# Altium project Display.PrjPCB
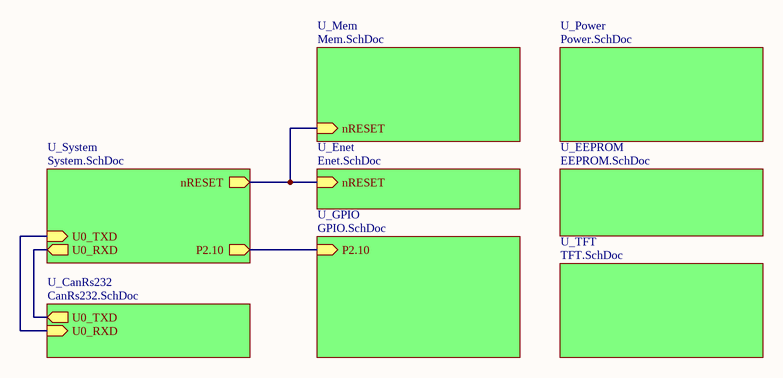
[diagram p0: Top.SchDoc]
9 sheets, 139 parts. Net scope: hierarchical (ports join the sheet entries above them; power ports are global).
Board file: DISPLAY.PcbDoc
Sheets:
  Top.SchDoc
    U_Power = Power.SchDoc
    U_CanRs232 = CanRs232.SchDoc
    U_EEPROM = EEPROM.SchDoc
    U_Enet = Enet.SchDoc
    U_GPIO = GPIO.SchDoc
    U_Mem = Mem.SchDoc
    U_System = System.SchDoc
    U_TFT = TFT.SchDoc

## Sheet Top.SchDoc
size A4

### Sub-sheets
U_CanRs232 = CanRs232.SchDoc: U0_TXD (out), U0_RXD (in)
U_EEPROM = EEPROM.SchDoc: no entries
U_Enet = Enet.SchDoc: nRESET (in)
U_GPIO = GPIO.SchDoc: P2.10 (in)
U_Mem = Mem.SchDoc: nRESET (in)
U_Power = Power.SchDoc: no entries
U_System = System.SchDoc: nRESET (out), P2.10 (out), U0_TXD (in), U0_RXD (out)
U_TFT = TFT.SchDoc: no entries

### Nets
nRESET: sheet U_Enet/nRESET, sheet U_Mem/nRESET, sheet U_System/nRESET
P2.10: sheet U_GPIO/P2.10, sheet U_System/P2.10
U0_RXD: sheet U_CanRs232/U0_TXD, sheet U_System/U0_RXD
U0_TXD: sheet U_CanRs232/U0_RXD, sheet U_System/U0_TXD

## Sheet Power.SchDoc
size 203 x 152 mm; SheetNumber: 0; SheetTotal: 0
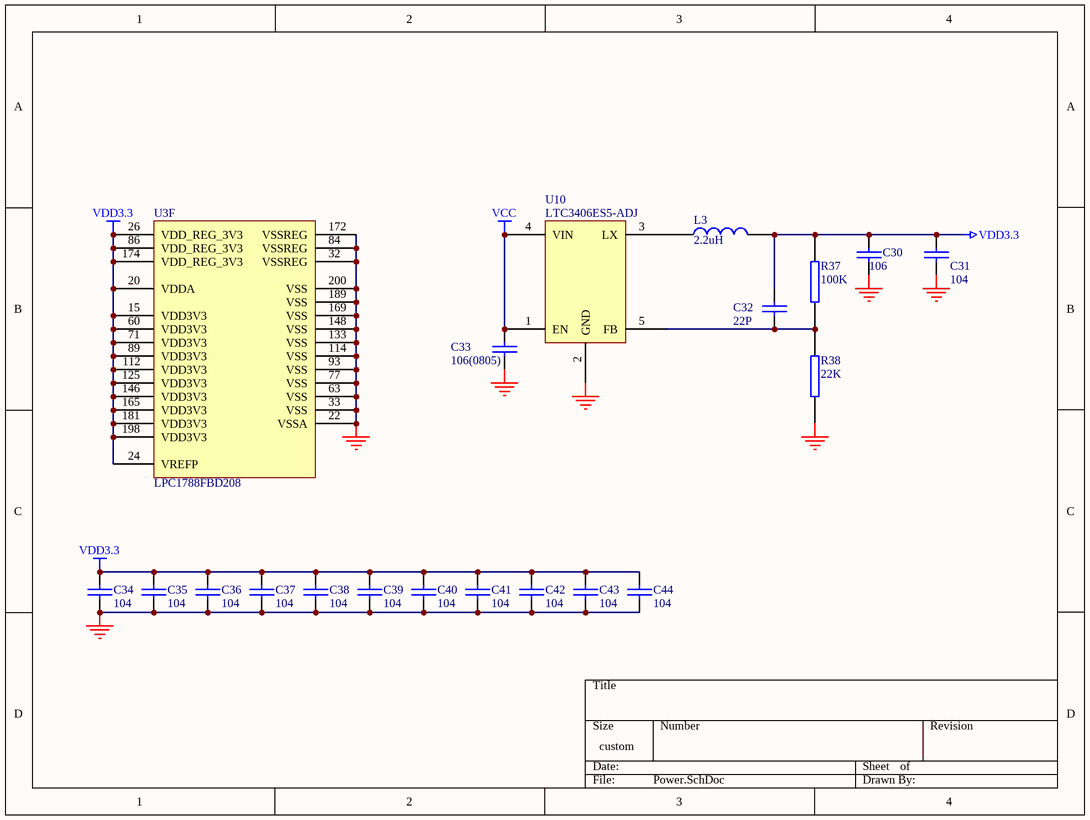
[diagram p1: Power.SchDoc]

### Parts
C30  106  [C0805]
C31  104  [C0603]
C32  22P  [C0603]
C33  106(0805)  [C0805]
C34  104  [C0603]
C35  104  [C0603]
C36  104  [C0603]
C37  104  [C0603]
C38  104  [C0603]
C39  104  [C0603]
C40  104  [C0603]
C41  104  [C0603]
C42  104  [C0603]
C43  104  [C0603]
C44  104  [C0603]
L3  2.2uH  [L4X4]
R37  100K  [R0603]
R38  22K  [R0603]
U3  LPC1788FBD208  [QFP208]  (part F of 8)
U10  LTC3406ES5-ADJ  [SOT23-5]

### Nets
GND: C30.2 C31.2 C33.2 C34.2 C35.2 C36.2 C37.2 C38.2 C39.2 C40.2 C41.2 C42.2 C43.2 C44.2 R38.2 U3.22(VSSA) U3.32(VSSREG) U3.33(VSS) U3.63(VSS) U3.77(VSS) U3.84(VSSREG) U3.93(VSS) U3.114(VSS) U3.133(VSS) U3.148(VSS) U3.169(VSS) U3.172(VSSREG) U3.189(VSS) U3.200(VSS) U10.2(GND)
VCC: C33.1 U10.1(EN) U10.4(VIN)
VDD3.3: C30.1 C31.1 C32.1 C34.1 C35.1 C36.1 C37.1 C38.1 C39.1 C40.1 C41.1 C42.1 C43.1 C44.1 L3.2 R37.2 U3.15(VDD3V3) U3.20(VDDA) U3.24(VREFP) U3.26(VDD_REG_3V3) U3.60(VDD3V3) U3.71(VDD3V3) U3.86(VDD_REG_3V3) U3.89(VDD3V3) U3.112(VDD3V3) U3.125(VDD3V3) U3.146(VDD3V3) U3.165(VDD3V3) U3.174(VDD_REG_3V3) U3.181(VDD3V3) U3.198(VDD3V3)
NetC32_2: C32.2 R37.1 R38.1 U10.5(FB)
NetL3_1: L3.1 U10.3(LX)

### Library data of the parts
C30-C44 = CAP: Capacitor
L3 = INDUCTOR
R37 R38 = RES2
U10 = LTC3406ES5/RT8008

## Sheet CanRs232.SchDoc
size A; SheetNumber: 0; SheetTotal: 0
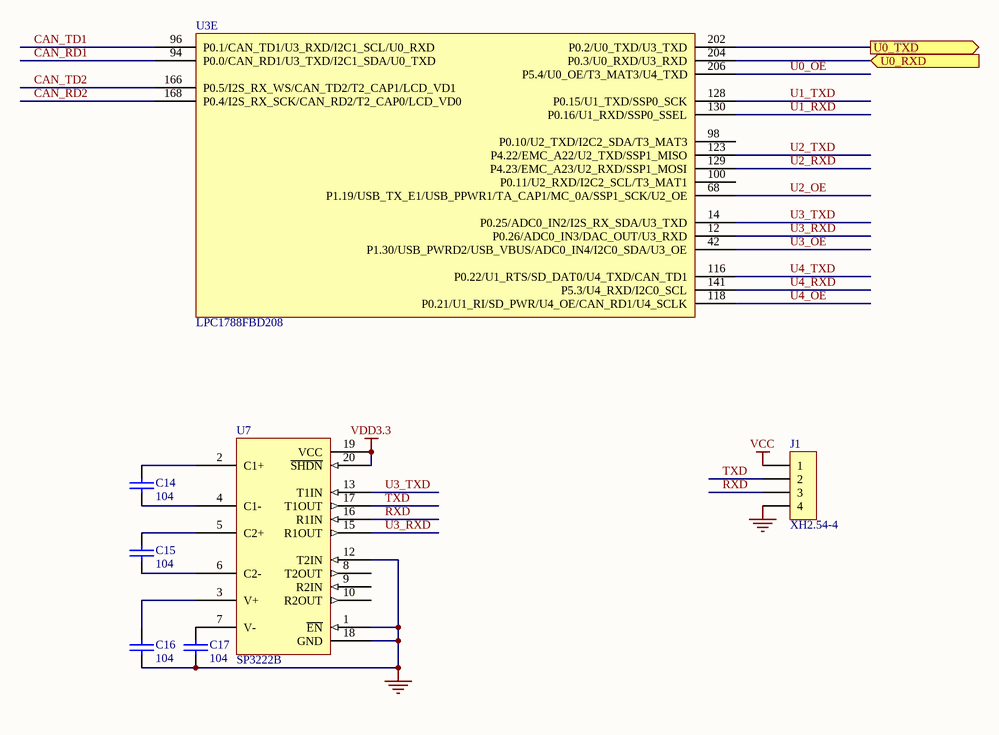
[diagram p2: CanRs232.SchDoc]

### Parts
C14  104  [C1206]
C15  104  [C1206]
C16  104  [C1206]
C17  104  [C1206]
J1  XH2.54-4  [A2501WF-04A]
U3  LPC1788FBD208  [QFP208]  (part E of 8)
U7  SP3222B  [TSSOP20]

### Ports
U0_RXD (in), U0_TXD (out)

### Nets
GND: C16.2 C17.2 J1.4 U7.1(~{EN}) U7.12(T2IN) U7.18(GND)
NC: U7.11(NC) U7.14(NC)
VCC: J1.1
VDD3.3: U7.19(VCC) U7.20(~{SHDN})
CAN_RD1: U3.94(P0.0/CAN_RD1/U3_TXD/I2C1_SDA/U0_TXD)
CAN_RD2: U3.168(P0.4/I2S_RX_SCK/CAN_RD2/T2_CAP0/LCD_VD0)
CAN_TD1: U3.96(P0.1/CAN_TD1/U3_RXD/I2C1_SCL/U0_RXD)
CAN_TD2: U3.166(P0.5/I2S_RX_WS/CAN_TD2/T2_CAP1/LCD_VD1)
RXD: J1.3 U7.16(R1IN)
TXD: J1.2 U7.17(T1OUT)
U0_OE: U3.206(P5.4/U0_OE/T3_MAT3/U4_TXD)
U0_RXD: U3.202(P0.2/U0_TXD/U3_TXD) ; port U0_TXD
U0_TXD: U3.204(P0.3/U0_RXD/U3_RXD) ; port U0_RXD
U1_RXD: U3.130(P0.16/U1_RXD/SSP0_SSEL)
U1_TXD: U3.128(P0.15/U1_TXD/SSP0_SCK)
U2_OE: U3.68(P1.19/USB_TX_E1/USB_PPWR1/TA_CAP1/MC_0A/SSP1_SCK/U2_OE)
U2_RXD: U3.129(P4.23/EMC_A23/U2_RXD/SSP1_MOSI)
U2_TXD: U3.123(P4.22/EMC_A22/U2_TXD/SSP1_MISO)
U3_OE: U3.42(P1.30/USB_PWRD2/USB_VBUS/ADC0_IN4/I2C0_SDA/U3_OE)
U3_RXD: U3.12(P0.26/ADC0_IN3/DAC_OUT/U3_RXD) U7.15(R1OUT)
U3_TXD: U3.14(P0.25/ADC0_IN2/I2S_RX_SDA/U3_TXD) U7.13(T1IN)
U4_OE: U3.118(P0.21/U1_RI/SD_PWR/U4_OE/CAN_RD1/U4_SCLK)
U4_RXD: U3.141(P5.3/U4_RXD/I2C0_SCL)
U4_TXD: U3.116(P0.22/U1_RTS/SD_DAT0/U4_TXD/CAN_TD1)
NetC14_1: C14.1 U7.2(C1+)
NetC14_2: C14.2 U7.4(C1-)
NetC15_1: C15.1 U7.5(C2+)
NetC15_2: C15.2 U7.6(C2-)
NetC16_1: C16.1 U7.3(V+)
NetC17_1: C17.1 U7.7(V-)

Not connected (* = marked no-connect by the designer): U3 98(P0.10/U2_TXD/I2C2_SDA/T3_MAT3) 100(P0.11/U2_RXD/I2C2_SCL/T3_MAT1); U7 8(T2OUT) 9(R2IN) 10(R2OUT)

### Library data of the parts
C14-C17 = CAP
J1 = XH2.54-4-SMD

## Sheet EEPROM.SchDoc
size 241 x 127 mm; SheetNumber: 0; SheetTotal: 0
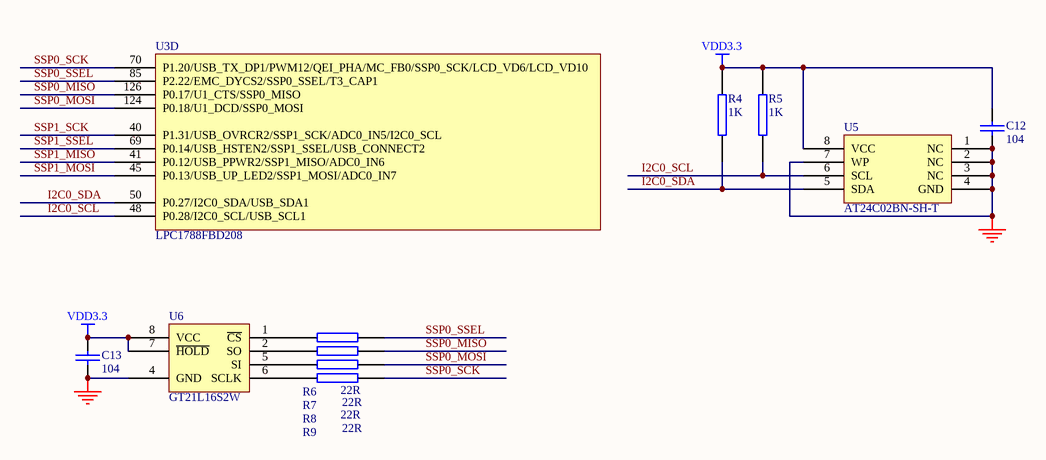
[diagram p3: EEPROM.SchDoc]

### Parts
C12  104  [C0603]
C13  104  [C0603]
R4  1K  [R0603]
R5  1K  [R0603]
R6  22R  [R0603]
R7  22R  [R0603]
R8  22R  [R0603]
R9  22R  [R0603]
U3  LPC1788FBD208  [QFP208]  (part D of 8)
U5  AT24C02BN-SH-T  [SOP8]
U6  GT21L16S2W  [SOP8]

### Nets
GND: C12.2 C13.2 U5.1(NC) U5.2(NC) U5.3(NC) U5.4(GND) U5.7(WP) U6.4(GND)
NC: U6.3(NC)
VDD3.3: C12.1 C13.1 R4.2 R5.2 U5.8(VCC) U6.7(~{HOLD}) U6.8(VCC)
I2C0_SCL: R5.1 U3.48(P0.28/I2C0_SCL/USB_SCL1) U5.6(SCL)
I2C0_SDA: R4.1 U3.50(P0.27/I2C0_SDA/USB_SDA1) U5.5(SDA)
SSP0_MISO: R7.2 U3.126(P0.17/U1_CTS/SSP0_MISO)
SSP0_MOSI: R8.2 U3.124(P0.18/U1_DCD/SSP0_MOSI)
SSP0_SCK: R9.2 U3.70(P1.20/USB_TX_DP1/PWM12/QEI_PHA/MC_FB0/SSP0_SCK/LCD_VD6/LCD_VD10)
SSP0_SSEL: R6.2 U3.85(P2.22/EMC_DYCS2/SSP0_SSEL/T3_CAP1)
SSP1_MISO: U3.41(P0.12/USB_PPWR2/SSP1_MISO/ADC0_IN6)
SSP1_MOSI: U3.45(P0.13/USB_UP_LED2/SSP1_MOSI/ADC0_IN7)
SSP1_SCK: U3.40(P1.31/USB_OVRCR2/SSP1_SCK/ADC0_IN5/I2C0_SCL)
SSP1_SSEL: U3.69(P0.14/USB_HSTEN2/SSP1_SSEL/USB_CONNECT2)
NetR6_1: R6.1 U6.1(~{CS})
NetR7_1: R7.1 U6.2(SO)
NetR8_1: R8.1 U6.5(SI)
NetR9_1: R9.1 U6.6(SCLK)

### Library data of the parts
C12 C13 = CAP: Capacitor
R4-R9 = RES2
U5 = AT24C02
U6 = GT21L16T1W

## Sheet Enet.SchDoc
size B; SheetNumber: 0; SheetTotal: 0
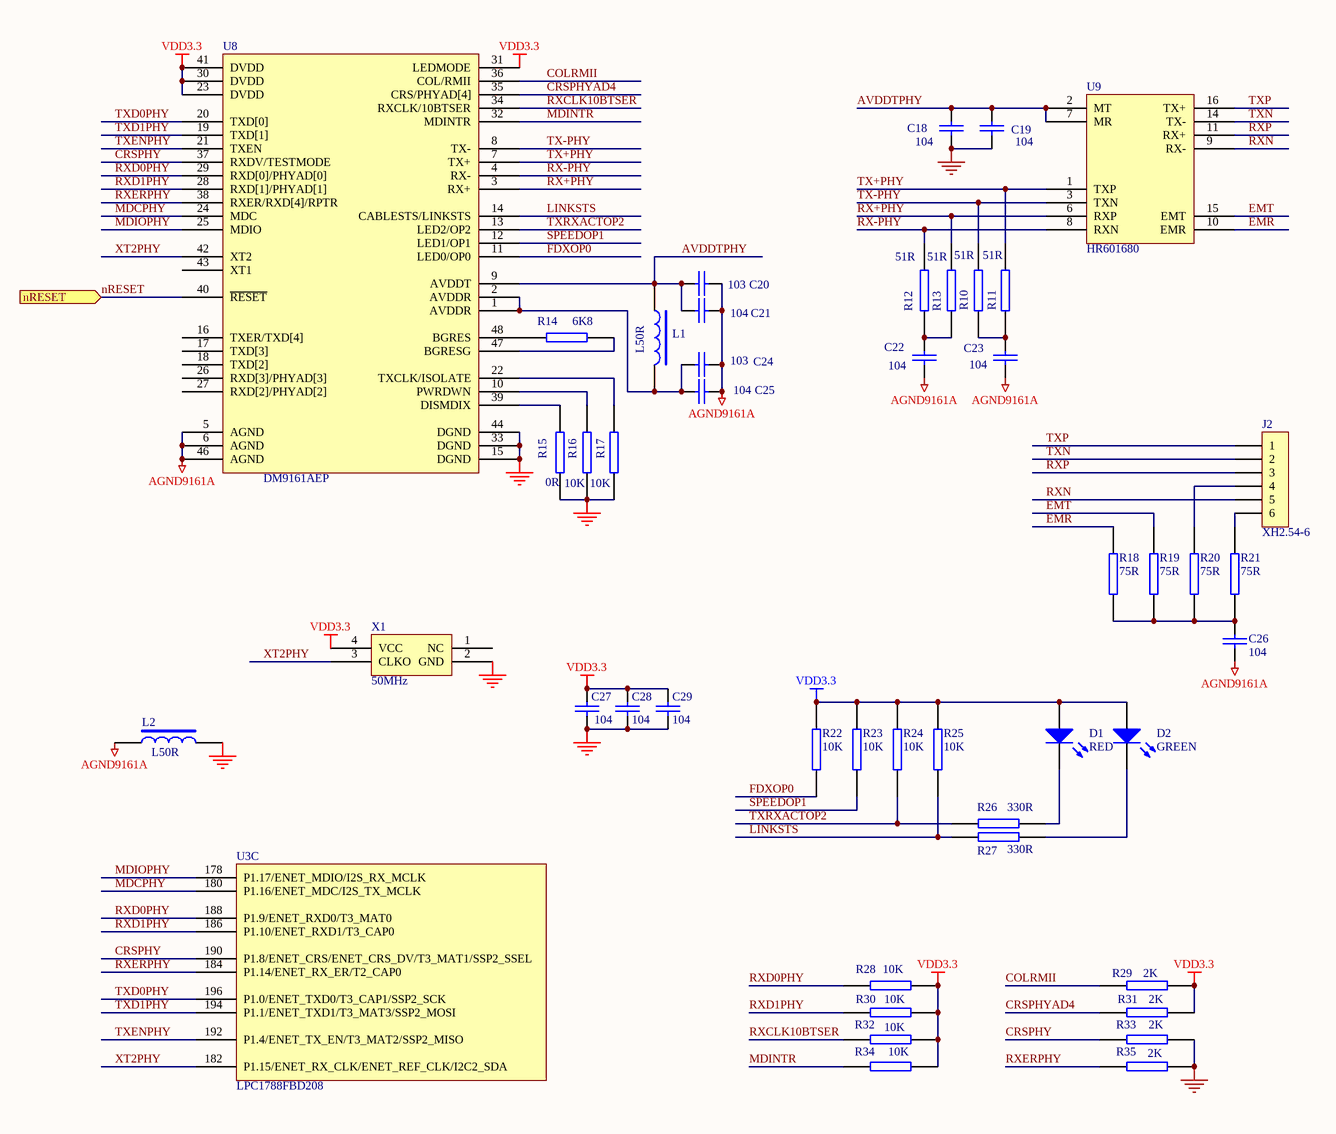
[diagram p4: Enet.SchDoc]

### Parts
C18  104  [C0603]
C19  104  [C0603]
C20  103  [C0603]
C21  104  [C0603]
C22  104  [C0603]
C23  104  [C0603]
C24  103  [C0603]
C25  104  [C0603]
C26  104  [C0603]
C27  104  [C0603]
C28  104  [C0603]
C29  104  [C0603]
D1  RED  [LED0603]
D2  GREEN  [LED0603]
J2  XH2.54-6  [A2501WF-06A]
L1  L50R  [BEADL]
L2  L50R  [BEADL]
R10  51R  [R0603]
R11  51R  [R0603]
R12  51R  [R0603]
R13  51R  [R0603]
R14  6K8  [R0603]
R15  0R  [R0603]
R16  10K  [R0603]
R17  10K  [R0603]
R18  75R  [R0603]
R19  75R  [R0603]
R20  75R  [R0603]
R21  75R  [R0603]
R22  10K  [R0603]
R23  10K  [R0603]
R24  10K  [R0603]
R25  10K  [R0603]
R26  330R  [R0603]
R27  330R  [R0603]
R28  10K  [R0603]
R29  2K  [R0603]
R30  10K  [R0603]
R31  2K  [R0603]
R32  10K  [R0603]
R33  2K  [R0603]
R34  10K  [R0603]
R35  2K  [R0603]
U3  LPC1788FBD208  [QFP208]  (part C of 8)
U8  DM9161AEP  [PQFP48]
U9  HR601680  [HR601680]
X1  50MHz  [CRYSTAL5X8]

### Ports
nRESET (in)

### Nets
AGND9161A: C20.2 C21.2 C22.1 C23.1 C24.2 C25.2 C26.2 L2.1 U8.5(AGND) U8.6(AGND) U8.46(AGND)
GND: C18.1 C19.1 C27.2 C28.2 C29.2 L2.2 R15.1 R16.1 R17.1 R33.2 R35.2 U8.15(DGND) U8.33(DGND) U8.44(DGND) X1.2(GND)
NC: U8.45(NC) U9.4(NC) U9.5(NC) U9.12(NC) U9.13(NC)
VDD3.3: C27.1 C28.1 C29.1 D1.1(A) D2.1(A) R22.2 R23.2 R24.2 R25.2 R28.2 R29.2 R30.2 R31.2 R32.2 R34.2 U8.23(DVDD) U8.30(DVDD) U8.31(LEDMODE) U8.41(DVDD) X1.4(VCC)
AVDDTPHY: C18.2 C19.2 C20.1 C21.1 L1.1 U8.9(AVDDT) U9.2(MT) U9.7(MR)
COLRMII: R29.1 U8.36(COL/RMII)
CRSPHY: R33.1 U3.190(P1.8/ENET_CRS/ENET_CRS_DV/T3_MAT1/SSP2_SSEL) U8.37(RXDV/TESTMODE)
CRSPHYAD4: R31.1 U8.35(CRS/PHYAD[4])
EMR: R18.2 U9.10(EMR)
EMT: R19.2 U9.15(EMT)
FDXOP0: R22.1 U8.11(LED0/OP0)
LINKSTS: R25.1 R27.1 U8.14(CABLESTS/LINKSTS)
MDCPHY: U3.180(P1.16/ENET_MDC/I2S_TX_MCLK) U8.24(MDC)
MDINTR: R34.1 U8.32(MDINTR)
MDIOPHY: U3.178(P1.17/ENET_MDIO/I2S_RX_MCLK) U8.25(MDIO)
nRESET: U8.40(~{RESET}) ; port nRESET
RX+PHY: R13.2 U8.3(RX+) U9.6(RXP)
RX-PHY: R12.2 U8.4(RX-) U9.8(RXN)
RXCLK10BTSER: R32.1 U8.34(RXCLK/10BTSER)
RXD0PHY: R28.1 U3.188(P1.9/ENET_RXD0/T3_MAT0) U8.29(RXD[0]/PHYAD[0])
RXD1PHY: R30.1 U3.186(P1.10/ENET_RXD1/T3_CAP0) U8.28(RXD[1]/PHYAD[1])
RXERPHY: R35.1 U3.184(P1.14/ENET_RX_ER/T2_CAP0) U8.38(RXER/RXD[4]/RPTR)
RXN: J2.5 U9.9(RX-)
RXP: J2.3 U9.11(RX+)
SPEEDOP1: R23.1 U8.12(LED1/OP1)
TX+PHY: R11.2 U8.7(TX+) U9.1(TXP)
TX-PHY: R10.2 U8.8(TX-) U9.3(TXN)
TXD0PHY: U3.196(P1.0/ENET_TXD0/T3_CAP1/SSP2_SCK) U8.20(TXD[0])
TXD1PHY: U3.194(P1.1/ENET_TXD1/T3_MAT3/SSP2_MOSI) U8.19(TXD[1])
TXENPHY: U3.192(P1.4/ENET_TX_EN/T3_MAT2/SSP2_MISO) U8.21(TXEN)
TXN: J2.2 U9.14(TX-)
TXP: J2.1 U9.16(TX+)
TXRXACTOP2: R24.1 R26.1 U8.13(LED2/OP2)
XT2PHY: U3.182(P1.15/ENET_RX_CLK/ENET_REF_CLK/I2C2_SDA) U8.42(XT2) X1.3(CLKO)
NetC22_2: C22.2 R12.1 R13.1
NetC23_2: C23.2 R10.1 R11.1
NetC24_1: C24.1 C25.1 L1.2 U8.1(AVDDR) U8.2(AVDDR)
NetC26_1: C26.1 R18.1 R19.1 R20.1 R21.1
NetD1_2: D1.2(K) R26.2
NetD2_2: D2.2(K) R27.2
NetJ2_4: J2.4 R20.2
NetJ2_6: J2.6 R21.2
NetR14_1: R14.1 U8.47(BGRESG)
NetR14_2: R14.2 U8.48(BGRES)
NetR15_2: R15.2 U8.39(DISMDIX)
NetR16_2: R16.2 U8.10(PWRDWN)
NetR17_2: R17.2 U8.22(TXCLK/ISOLATE)

Not connected (* = marked no-connect by the designer): U8 16(TXER/TXD[4]) 17(TXD[3]) 18(TXD[2]) 26(RXD[3]/PHYAD[3]) 27(RXD[2]/PHYAD[2]) 43(XT1); X1 1(NC)

### Library data of the parts
C18-C29 = CAP: Capacitor
D1 D2 = LED0: Typical INFRARED GaAs LED; Published: 8-Jun-2000; LatestRevisionDate: 08-Jul-2005; LatestRevisionNote: Mech Layer 1 removed.; PackageReference: LED-0; Publisher: Altium Limited
J2 = XH2.54-6-SMD
L1 L2 = INDUCTOR2
R10-R35 = RES2
U8 = DM9161A
X1 = OSCILLATOR

## Sheet GPIO.SchDoc
size A; SheetNumber: 0; SheetTotal: 0
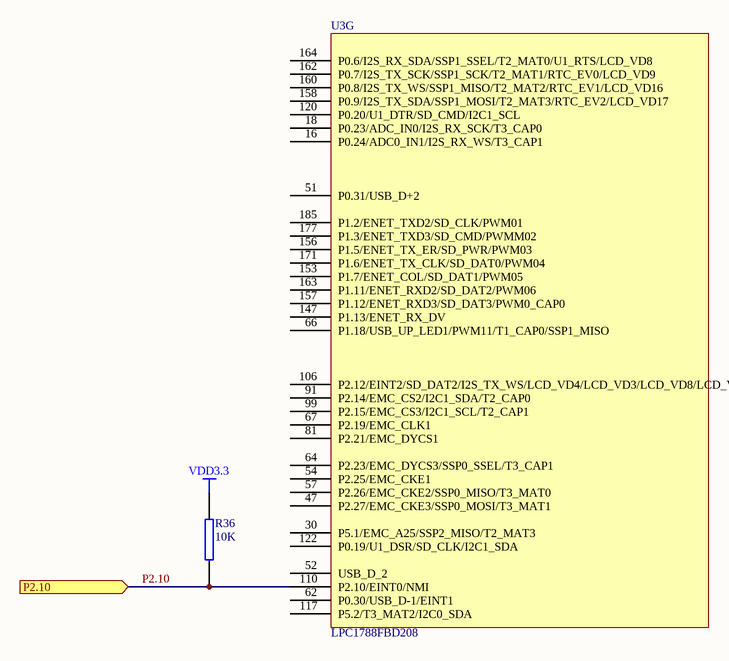
[diagram p5: GPIO.SchDoc]

### Parts
R36  10K  [R0603]
U3  LPC1788FBD208  [QFP208]  (part G of 8)

### Ports
P2.10 (in)

### Nets
VDD3.3: R36.2
P2.10: R36.1 U3.110(P2.10/EINT0/NMI) ; port P2.10

Not connected (* = marked no-connect by the designer): U3 16(P0.24/ADC0_IN1/I2S_RX_WS/T3_CAP1) 18(P0.23/ADC_IN0/I2S_RX_SCK/T3_CAP0) 30(P5.1/EMC_A25/SSP2_MISO/T2_MAT3) 47(P2.27/EMC_CKE3/SSP0_MOSI/T3_MAT1) 51(P0.31/USB_D+2) 52(USB_D_2) 54(P2.25/EMC_CKE1) 57(P2.26/EMC_CKE2/SSP0_MISO/T3_MAT0) 62(P0.30/USB_D-1/EINT1) 64(P2.23/EMC_DYCS3/SSP0_SSEL/T3_CAP1) 66(P1.18/USB_UP_LED1/PWM11/T1_CAP0/SSP1_MISO) 67(P2.19/EMC_CLK1) 81(P2.21/EMC_DYCS1) 91(P2.14/EMC_CS2/I2C1_SDA/T2_CAP0) 99(P2.15/EMC_CS3/I2C1_SCL/T2_CAP1) 106(P2.12/EINT2/SD_DAT2/I2S_TX_WS/LCD_VD4/LCD_VD3/LCD_VD8/LCD_VD18) 117(P5.2/T3_MAT2/I2C0_SDA) 120(P0.20/U1_DTR/SD_CMD/I2C1_SCL) 122(P0.19/U1_DSR/SD_CLK/I2C1_SDA) 147(P1.13/ENET_RX_DV) 153(P1.7/ENET_COL/SD_DAT1/PWM05) 156(P1.5/ENET_TX_ER/SD_PWR/PWM03) 157(P1.12/ENET_RXD3/SD_DAT3/PWM0_CAP0) 158(P0.9/I2S_TX_SDA/SSP1_MOSI/T2_MAT3/RTC_EV2/LCD_VD17) 160(P0.8/I2S_TX_WS/SSP1_MISO/T2_MAT2/RTC_EV1/LCD_VD16) 162(P0.7/I2S_TX_SCK/SSP1_SCK/T2_MAT1/RTC_EV0/LCD_VD9) 163(P1.11/ENET_RXD2/SD_DAT2/PWM06) 164(P0.6/I2S_RX_SDA/SSP1_SSEL/T2_MAT0/U1_RTS/LCD_VD8) 171(P1.6/ENET_TX_CLK/SD_DAT0/PWM04) 177(P1.3/ENET_TXD3/SD_CMD/PWMM02) 185(P1.2/ENET_TXD2/SD_CLK/PWM01)

### Library data of the parts
R36 = RES2

## Sheet Mem.SchDoc
size 355 x 254 mm; SheetNumber: 0; SheetTotal: 0
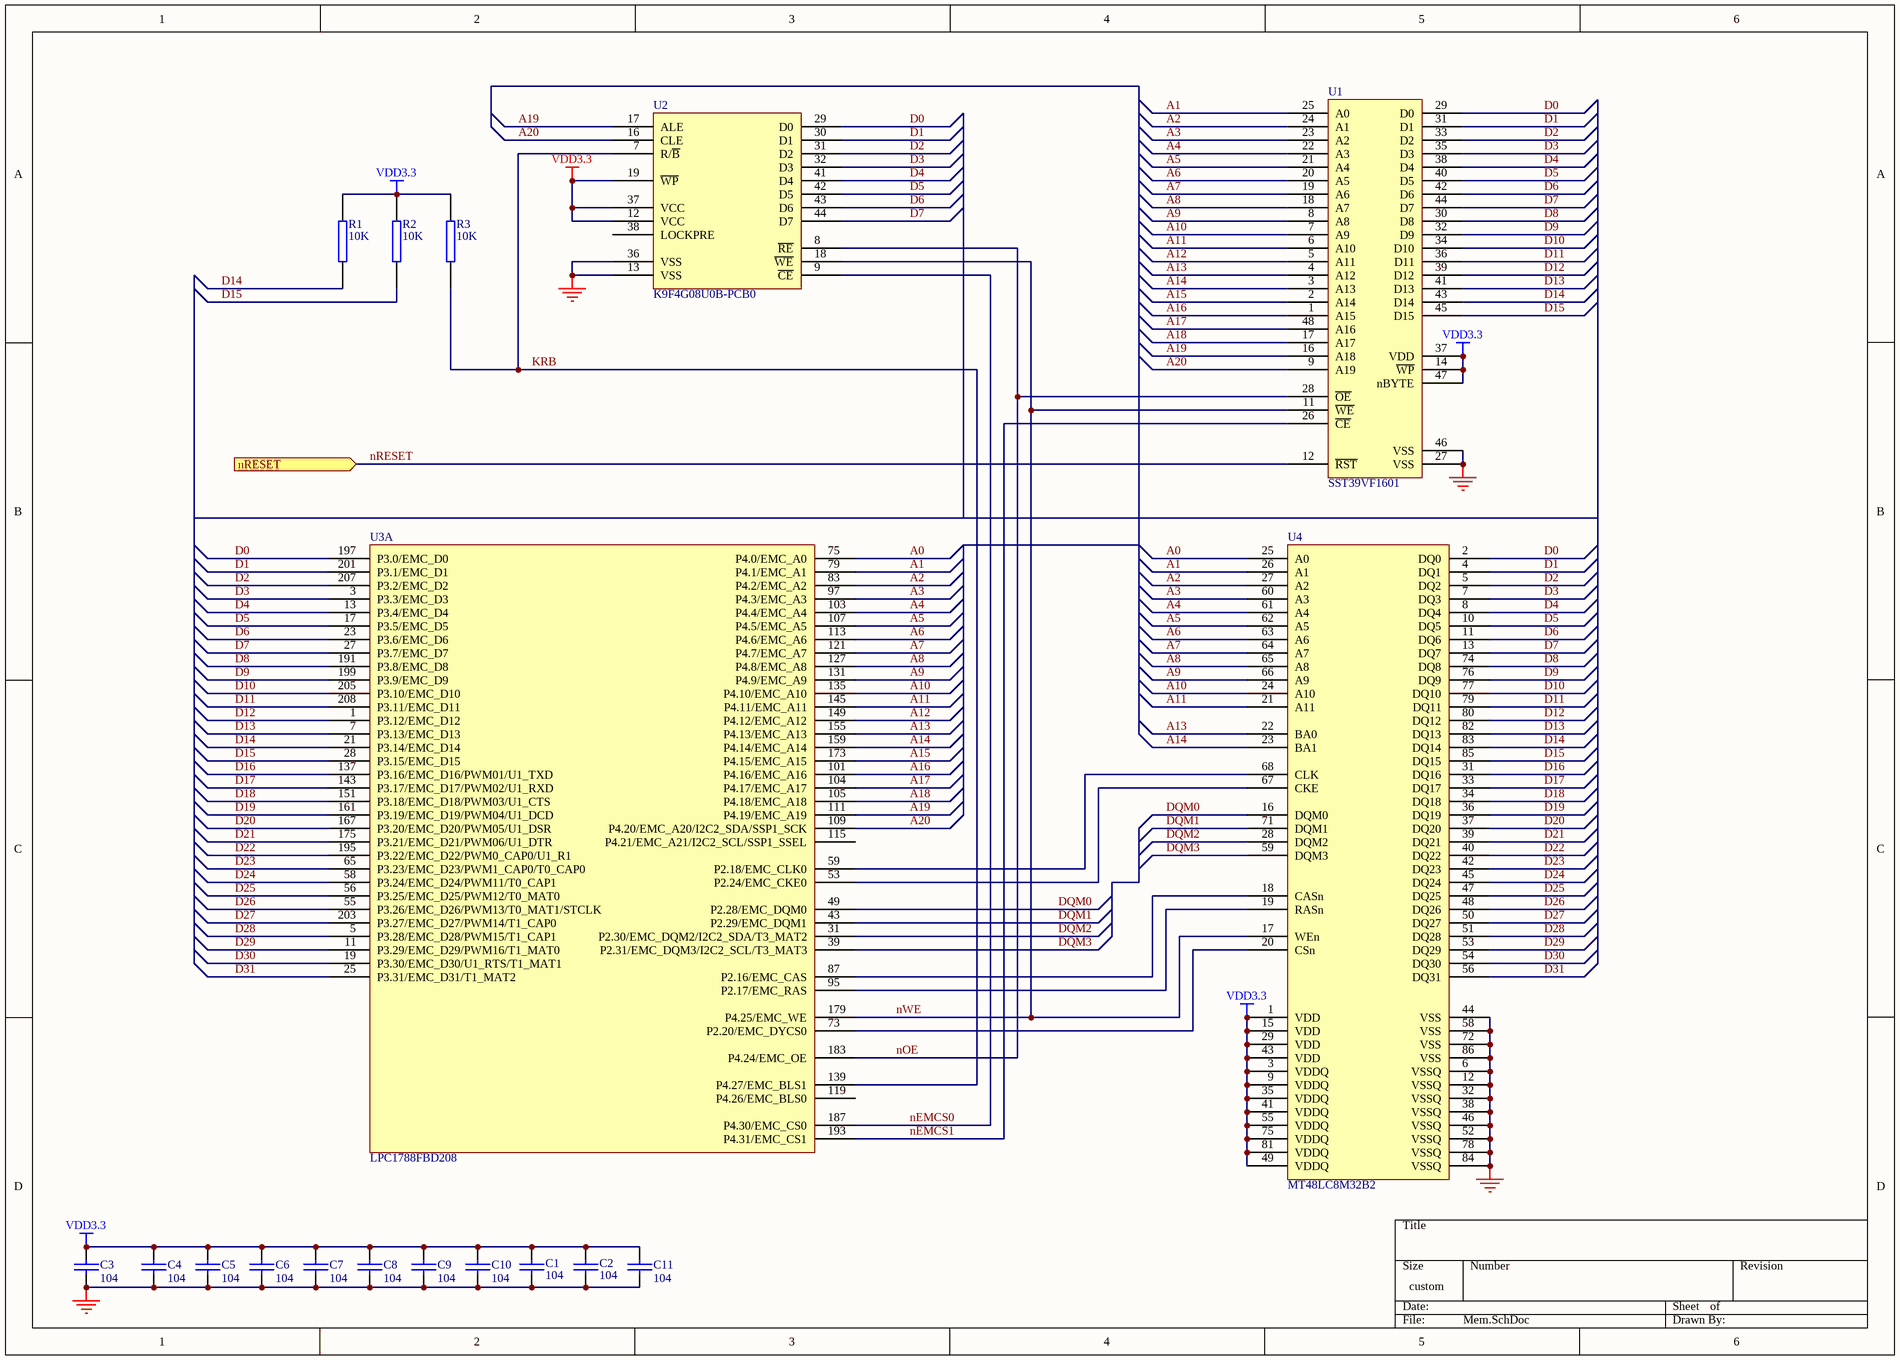
[diagram p6: Mem.SchDoc]

### Parts
C1  104  [C0603]
C2  104  [C0603]
C3  104  [C0603]
C4  104  [C0603]
C5  104  [C0603]
C6  104  [C0603]
C7  104  [C0603]
C8  104  [C0603]
C9  104  [C0603]
C10  104  [C0603]
C11  104  [C0603]
R1  10K  [R0603]
R2  10K  [R0603]
R3  10K  [R0603]
U1  SST39VF1601  [SST39VF1601]
U2  K9F4G08U0B-PCB0  [K9F4G08U0B]
U3  LPC1788FBD208  [QFP208]  (part A of 8)
U4  MT48LC8M32B2  [TSOP86]

### Ports
nRESET (in)

### Nets
GND: C1.2 C2.2 C3.2 C4.2 C5.2 C6.2 C7.2 C8.2 C9.2 C10.2 C11.2 U1.27(VSS) U1.46(VSS) U2.13(VSS) U2.36(VSS) U4.6(VSSQ) U4.12(VSSQ) U4.32(VSSQ) U4.38(VSSQ) U4.44(VSS) U4.46(VSSQ) U4.52(VSSQ) U4.58(VSS) U4.72(VSS) U4.78(VSSQ) U4.84(VSSQ) U4.86(VSS)
NC: U1.10(NC) U1.13(NC) U1.15(NC) U2.1(NC) U2.2(NC) U2.3(NC) U2.4(NC) U2.5(NC) U2.6(NC) U2.10(NC) U2.11(NC) U2.14(NC) U2.15(NC) U2.20(NC) U2.21(NC) U2.22(NC) U2.23(NC) U2.24(NC) U2.25(NC) U2.26(NC) U2.27(NC) U2.28(NC) U2.33(NC) U2.34(NC) U2.35(NC) U2.39(NC) U2.40(NC) U2.45(NC) U2.46(NC) U2.47(NC) U2.48(NC) U4.14(NC) U4.30(NC) U4.57(NC) U4.69(NC) U4.70(NC) U4.73(NC)
VDD3.3: C1.1 C2.1 C3.1 C4.1 C5.1 C6.1 C7.1 C8.1 C9.1 C10.1 C11.1 R1.2 R2.2 R3.2 U1.14(~{WP}) U1.37(VDD) U1.47(nBYTE) U2.12(VCC) U2.19(~{WP}) U2.37(VCC) U4.1(VDD) U4.3(VDDQ) U4.9(VDDQ) U4.15(VDD) U4.29(VDD) U4.35(VDDQ) U4.41(VDDQ) U4.43(VDD) U4.49(VDDQ) U4.55(VDDQ) U4.75(VDDQ) U4.81(VDDQ)
A0: U3.75(P4.0/EMC_A0) U4.25(A0)
A1: U1.25(A0) U3.79(P4.1/EMC_A1) U4.26(A1)
A2: U1.24(A1) U3.83(P4.2/EMC_A2) U4.27(A2)
A3: U1.23(A2) U3.97(P4.3/EMC_A3) U4.60(A3)
A4: U1.22(A3) U3.103(P4.4/EMC_A4) U4.61(A4)
A5: U1.21(A4) U3.107(P4.5/EMC_A5) U4.62(A5)
A6: U1.20(A5) U3.113(P4.6/EMC_A6) U4.63(A6)
A7: U1.19(A6) U3.121(P4.7/EMC_A7) U4.64(A7)
A8: U1.18(A7) U3.127(P4.8/EMC_A8) U4.65(A8)
A9: U1.8(A8) U3.131(P4.9/EMC_A9) U4.66(A9)
A10: U1.7(A9) U3.135(P4.10/EMC_A10) U4.24(A10)
A11: U1.6(A10) U3.145(P4.11/EMC_A11) U4.21(A11)
A12: U1.5(A11) U3.149(P4.12/EMC_A12)
A13: U1.4(A12) U3.155(P4.13/EMC_A13) U4.22(BA0)
A14: U1.3(A13) U3.159(P4.14/EMC_A14) U4.23(BA1)
A15: U1.2(A14) U3.173(P4.15/EMC_A15)
A16: U1.1(A15) U3.101(P4.16/EMC_A16)
A17: U1.48(A16) U3.104(P4.17/EMC_A17)
A18: U1.17(A17) U3.105(P4.18/EMC_A18)
A19: U1.16(A18) U2.17(ALE) U3.111(P4.19/EMC_A19)
A20: U1.9(A19) U2.16(CLE) U3.109(P4.20/EMC_A20/I2C2_SDA/SSP1_SCK)
D0: U1.29(D0) U2.29(D0) U3.197(P3.0/EMC_D0) U4.2(DQ0)
D1: U1.31(D1) U2.30(D1) U3.201(P3.1/EMC_D1) U4.4(DQ1)
D2: U1.33(D2) U2.31(D2) U3.207(P3.2/EMC_D2) U4.5(DQ2)
D3: U1.35(D3) U2.32(D3) U3.3(P3.3/EMC_D3) U4.7(DQ3)
D4: U1.38(D4) U2.41(D4) U3.13(P3.4/EMC_D4) U4.8(DQ4)
D5: U1.40(D5) U2.42(D5) U3.17(P3.5/EMC_D5) U4.10(DQ5)
D6: U1.42(D6) U2.43(D6) U3.23(P3.6/EMC_D6) U4.11(DQ6)
D7: U1.44(D7) U2.44(D7) U3.27(P3.7/EMC_D7) U4.13(DQ7)
D8: U1.30(D8) U3.191(P3.8/EMC_D8) U4.74(DQ8)
D9: U1.32(D9) U3.199(P3.9/EMC_D9) U4.76(DQ9)
D10: U1.34(D10) U3.205(P3.10/EMC_D10) U4.77(DQ10)
D11: U1.36(D11) U3.208(P3.11/EMC_D11) U4.79(DQ11)
D12: U1.39(D12) U3.1(P3.12/EMC_D12) U4.80(DQ12)
D13: U1.41(D13) U3.7(P3.13/EMC_D13) U4.82(DQ13)
D14: R1.1 U1.43(D14) U3.21(P3.14/EMC_D14) U4.83(DQ14)
D15: R2.1 U1.45(D15) U3.28(P3.15/EMC_D15) U4.85(DQ15)
D16: U3.137(P3.16/EMC_D16/PWM01/U1_TXD) U4.31(DQ16)
D17: U3.143(P3.17/EMC_D17/PWM02/U1_RXD) U4.33(DQ17)
D18: U3.151(P3.18/EMC_D18/PWM03/U1_CTS) U4.34(DQ18)
D19: U3.161(P3.19/EMC_D19/PWM04/U1_DCD) U4.36(DQ19)
D20: U3.167(P3.20/EMC_D20/PWM05/U1_DSR) U4.37(DQ20)
D21: U3.175(P3.21/EMC_D21/PWM06/U1_DTR) U4.39(DQ21)
D22: U3.195(P3.22/EMC_D22/PWM0_CAP0/U1_R1) U4.40(DQ22)
D23: U3.65(P3.23/EMC_D23/PWM1_CAP0/T0_CAP0) U4.42(DQ23)
D24: U3.58(P3.24/EMC_D24/PWM11/T0_CAP1) U4.45(DQ24)
D25: U3.56(P3.25/EMC_D25/PWM12/T0_MAT0) U4.47(DQ25)
D26: U3.55(P3.26/EMC_D26/PWM13/T0_MAT1/STCLK) U4.48(DQ26)
D27: U3.203(P3.27/EMC_D27/PWM14/T1_CAP0) U4.50(DQ27)
D28: U3.5(P3.28/EMC_D28/PWM15/T1_CAP1) U4.51(DQ28)
D29: U3.11(P3.29/EMC_D29/PWM16/T1_MAT0) U4.53(DQ29)
D30: U3.19(P3.30/EMC_D30/U1_RTS/T1_MAT1) U4.54(DQ30)
D31: U3.25(P3.31/EMC_D31/T1_MAT2) U4.56(DQ31)
DQM0: U3.49(P2.28/EMC_DQM0) U4.16(DQM0)
DQM1: U3.43(P2.29/EMC_DQM1) U4.71(DQM1)
DQM2: U3.31(P2.30/EMC_DQM2/I2C2_SDA/T3_MAT2) U4.28(DQM2)
DQM3: U3.39(P2.31/EMC_DQM3/I2C2_SCL/T3_MAT3) U4.59(DQM3)
KRB: R3.1 U2.7(R/~{B}) U3.139(P4.27/EMC_BLS1)
nEMCS0: U2.9(~{CE}) U3.187(P4.30/EMC_CS0)
nEMCS1: U1.26(~{CE}) U3.193(P4.31/EMC_CS1)
nOE: U1.28(~{OE}) U2.8(~{RE}) U3.183(P4.24/EMC_OE)
nRESET: U1.12(~{RST}) ; port nRESET
nWE: U1.11(~{WE}) U2.18(~{WE}) U3.179(P4.25/EMC_WE) U4.17(WEn)
NetU3_53: U3.53(P2.24/EMC_CKE0) U4.67(CKE)
NetU3_59: U3.59(P2.18/EMC_CLK0) U4.68(CLK)
NetU3_73: U3.73(P2.20/EMC_DYCS0) U4.20(CSn)
NetU3_87: U3.87(P2.16/EMC_CAS) U4.18(CASn)
NetU3_95: U3.95(P2.17/EMC_RAS) U4.19(RASn)

Not connected (* = marked no-connect by the designer): U2 38(LOCKPRE); U3 115(P4.21/EMC_A21/I2C2_SCL/SSP1_SSEL) 119(P4.26/EMC_BLS0)

### Library data of the parts
C1-C11 = CAP: Capacitor
R1-R3 = RES2
U2 = K9F5608U0D-PCB0

## Sheet System.SchDoc
size 304 x 203 mm; SheetNumber: 0; SheetTotal: 0
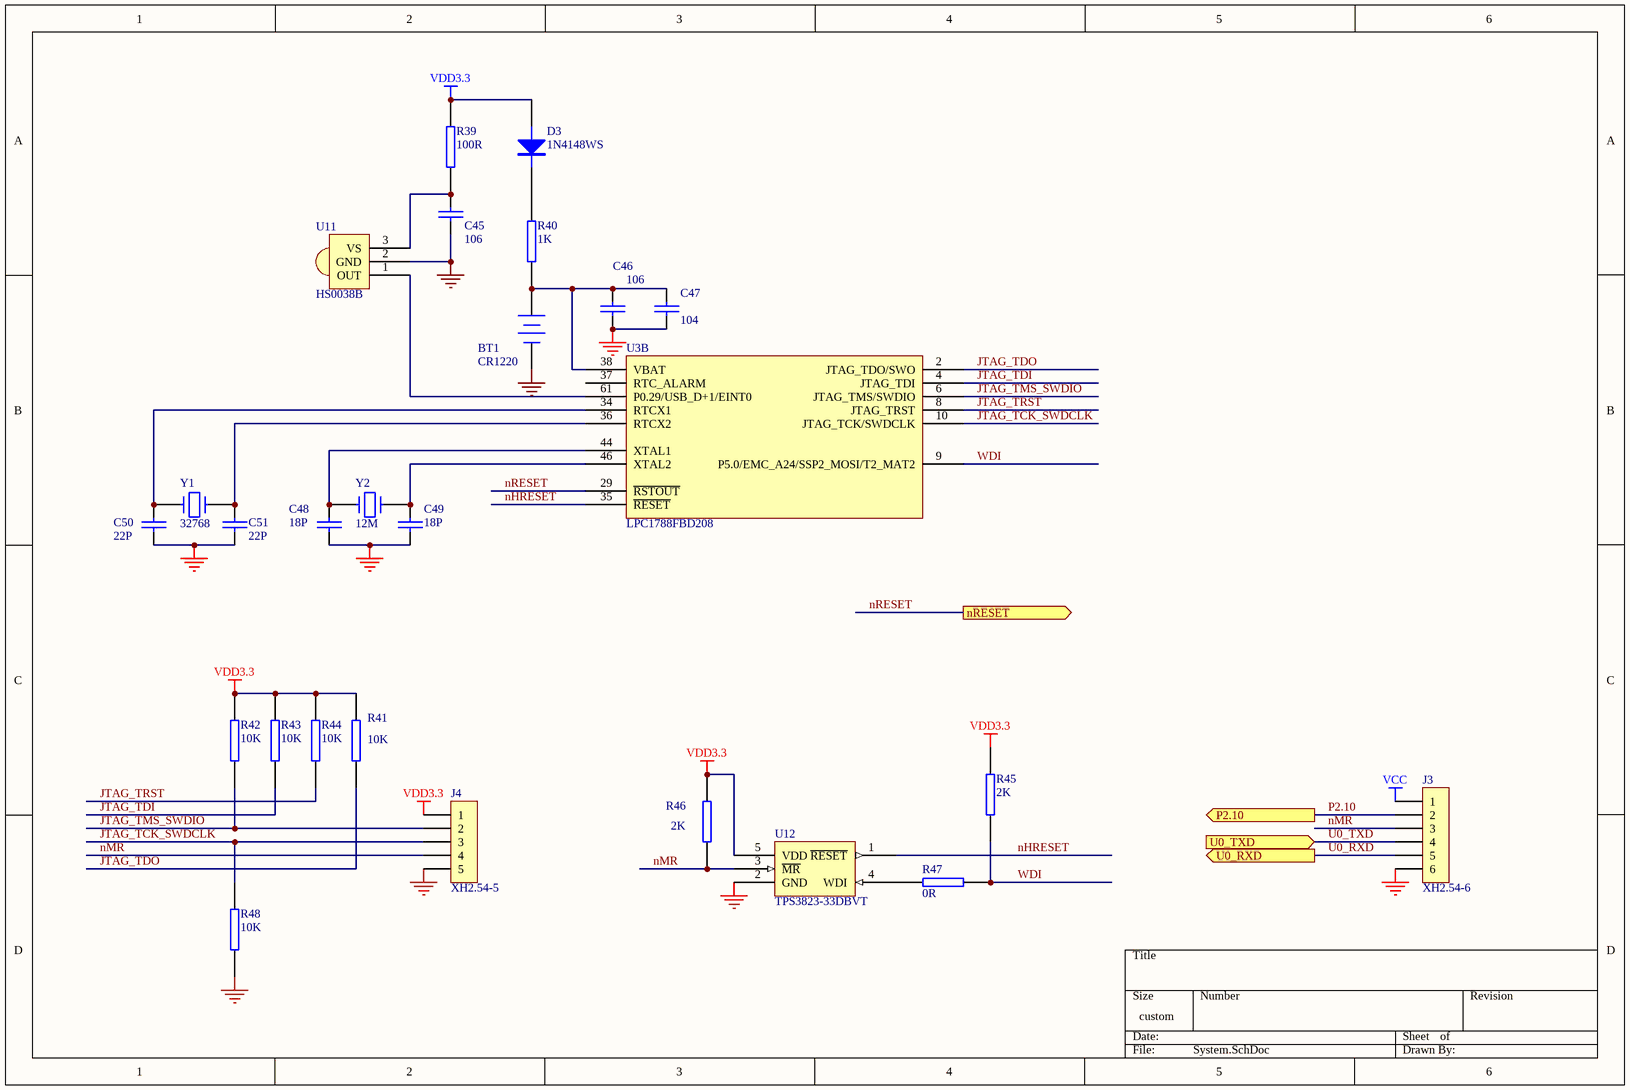
[diagram p7: System.SchDoc]

### Parts
BT1  CR1220  [CR1220]
C45  106  [C0603]
C46  106  [C0603]
C47  104  [C0603]
C48  18P  [C0603]
C49  18P  [C0603]
C50  22P  [C0603]
C51  22P  [C0603]
D3  1N4148WS  [SOD323]
J3  XH2.54-6  [A2501WF-06A]
J4  XH2.54-5  [A2501WF-05A]
R39  100R  [R0603]
R40  1K  [R0603]
R41  10K  [R0603]
R42  10K  [R0603]
R43  10K  [R0603]
R44  10K  [R0603]
R45  2K  [R0603]
R46  2K  [R0603]
R47  0R  [R0603]
R48  10K  [R0603]
U3  LPC1788FBD208  [QFP208]  (part B of 8)
U11  HS0038B  [HS0038B]
U12  TPS3823-33DBVT  [TSOP-5]
Y1  32768  [MC-306]
Y2  12M  [CY5032]

### Ports
nRESET (out), P2.10 (out), U0_RXD (out), U0_TXD (in)

### Nets
GND: BT1.2(-) C45.2 C46.2 C47.2 C48.2 C49.2 C50.2 C51.2 J3.6 J4.5 R48.1 U11.2(GND) U12.2(GND)
VCC: J3.1
VDD3.3: D3.1(A) J4.1 R39.2 R41.2 R42.2 R43.2 R44.2 R45.2 R46.2 U12.5(VDD)
JTAG_TCK_SWDCLK: J4.3 R48.2 U3.10(JTAG_TCK/SWDCLK)
JTAG_TDI: R43.1 U3.4(JTAG_TDI)
JTAG_TDO: R41.1 U3.2(JTAG_TDO/SWO)
JTAG_TMS_SWDIO: J4.2 R42.1 U3.6(JTAG_TMS/SWDIO)
JTAG_TRST: R44.1 U3.8(JTAG_TRST)
nHRESET: U3.35(~{RESET}) U12.1(~{RESET})
nMR: J3.3 J4.4 R46.1 U12.3(~{MR})
nRESET: U3.29(~{RSTOUT}) ; port nRESET
P2.10: J3.2 ; port P2.10
U0_RXD: J3.5 ; port U0_RXD
U0_TXD: J3.4 ; port U0_TXD
WDI: R45.1 R47.2 U3.9(P5.0/EMC_A24/SSP2_MOSI/T2_MAT2)
NetBT1_1: BT1.1(+) C46.1 C47.1 R40.2 U3.38(VBAT)
NetC45_1: C45.1 R39.1 U11.3(VS)
NetC48_1: C48.1 U3.44(XTAL1) Y2.1
NetC49_1: C49.1 U3.46(XTAL2) Y2.2
NetC50_1: C50.1 U3.34(RTCX1) Y1.2
NetC51_1: C51.1 U3.36(RTCX2) Y1.1
NetD3_2: D3.2(K) R40.1
NetR47_1: R47.1 U12.4(WDI)
NetU3_61: U3.61(P0.29/USB_D+1/EINT0) U11.1(OUT)

Not connected (* = marked no-connect by the designer): U3 37(RTC_ALARM)

### Library data of the parts
BT1 = Battery: Multicell Battery; Published: 24-Mar-1999; LatestRevisionDate: 17-Jul-2002; LatestRevisionNote: Re-released for DXP Platform.; PackageReference: BAT-2; Publisher: Altium Limited
C45-C51 = CAP: Capacitor
D3 = DIODE
J3 = XH2.54-6-SMD
J4 = XH2.54-5-SMD
R39-R48 = RES2
Y1 Y2 = CRYSTAL

## Sheet TFT.SchDoc
size A; SheetNumber: 0; SheetTotal: 0
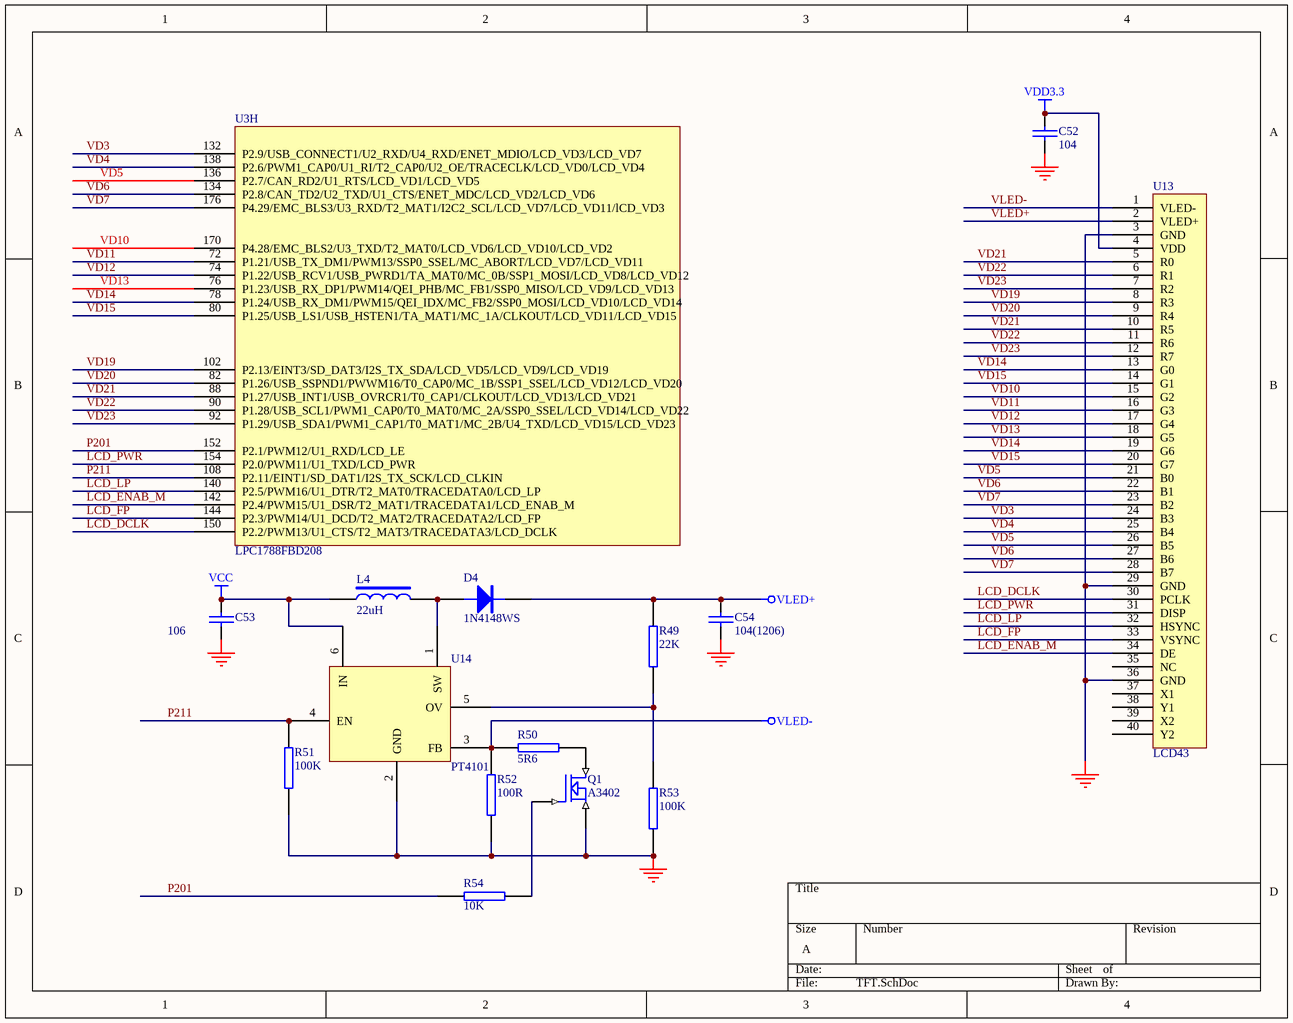
[diagram p8: TFT.SchDoc]

### Parts
C52  104  [C0603]
C53  106  [C0805]
C54  104(1206)  [C1206]
D4  1N4148WS  [SOD323]
L4  22uH  [L4X4]
Q1  A3402  [SOT23_9013]
R49  22K  [R0603]
R50  5R6  [R0603]
R51  100K  [R0603]
R52  100R  [R0603]
R53  100K  [R0603]
R54  10K  [R0603]
U3  LPC1788FBD208  [QFP208]  (part H of 8)
U13  LCD43  [SMTSOFT40]
U14  PT4101  [SOT23-6]

### Nets
GND: C52.2 C53.2 C54.2 Q1.3(S) R51.2 R52.2 R53.1 U13.3(GND) U13.29(GND) U13.36(GND) U14.2(GND)
VCC: C53.1 L4.1 U14.6(IN)
VDD3.3: C52.1 U13.4(VDD)
VLED+: C54.1 D4.2(K) R49.2 U13.2(VLED+)
VLED-: R50.2 R52.1 U13.1(VLED-) U14.3(FB)
LCD_DCLK: U3.150(P2.2/PWM13/U1_CTS/T2_MAT3/TRACEDATA3/LCD_DCLK) U13.30(PCLK)
LCD_ENAB_M: U3.142(P2.4/PWM15/U1_DSR/T2_MAT1/TRACEDATA1/LCD_ENAB_M) U13.34(DE)
LCD_FP: U3.144(P2.3/PWM14/U1_DCD/T2_MAT2/TRACEDATA2/LCD_FP) U13.33(VSYNC)
LCD_LP: U3.140(P2.5/PWM16/U1_DTR/T2_MAT0/TRACEDATA0/LCD_LP) U13.32(HSYNC)
LCD_PWR: U3.154(P2.0/PWM11/U1_TXD/LCD_PWR) U13.31(DISP)
P201: R54.1 U3.152(P2.1/PWM12/U1_RXD/LCD_LE)
P211: R51.1 U3.108(P2.11/EINT1/SD_DAT1/I2S_TX_SCK/LCD_CLKIN) U14.4(EN)
VD3: U3.132(P2.9/USB_CONNECT1/U2_RXD/U4_RXD/ENET_MDIO/LCD_VD3/LCD_VD7) U13.24(B3)
VD4: U3.138(P2.6/PWM1_CAP0/U1_RI/T2_CAP0/U2_OE/TRACECLK/LCD_VD0/LCD_VD4) U13.25(B4)
VD5: U3.136(P2.7/CAN_RD2/U1_RTS/LCD_VD1/LCD_VD5) U13.21(B0) U13.26(B5)
VD6: U3.134(P2.8/CAN_TD2/U2_TXD/U1_CTS/ENET_MDC/LCD_VD2/LCD_VD6) U13.22(B1) U13.27(B6)
VD7: U3.176(P4.29/EMC_BLS3/U3_RXD/T2_MAT1/I2C2_SCL/LCD_VD7/LCD_VD11/lCD_VD3) U13.23(B2) U13.28(B7)
VD10: U3.170(P4.28/EMC_BLS2/U3_TXD/T2_MAT0/LCD_VD6/LCD_VD10/LCD_VD2) U13.15(G2)
VD11: U3.72(P1.21/USB_TX_DM1/PWM13/SSP0_SSEL/MC_ABORT/LCD_VD7/LCD_VD11) U13.16(G3)
VD12: U3.74(P1.22/USB_RCV1/USB_PWRD1/TA_MAT0/MC_0B/SSP1_MOSI/LCD_VD8/LCD_VD12) U13.17(G4)
VD13: U3.76(P1.23/USB_RX_DP1/PWM14/QEI_PHB/MC_FB1/SSP0_MISO/LCD_VD9/LCD_VD13) U13.18(G5)
VD14: U3.78(P1.24/USB_RX_DM1/PWM15/QEI_IDX/MC_FB2/SSP0_MOSI/LCD_VD10/LCD_VD14) U13.13(G0) U13.19(G6)
VD15: U3.80(P1.25/USB_LS1/USB_HSTEN1/TA_MAT1/MC_1A/CLKOUT/LCD_VD11/LCD_VD15) U13.14(G1) U13.20(G7)
VD19: U3.102(P2.13/EINT3/SD_DAT3/I2S_TX_SDA/LCD_VD5/LCD_VD9/LCD_VD19) U13.8(R3)
VD20: U3.82(P1.26/USB_SSPND1/PWWM16/T0_CAP0/MC_1B/SSP1_SSEL/LCD_VD12/LCD_VD20) U13.9(R4)
VD21: U3.88(P1.27/USB_INT1/USB_OVRCR1/T0_CAP1/CLKOUT/LCD_VD13/LCD_VD21) U13.5(R0) U13.10(R5)
VD22: U3.90(P1.28/USB_SCL1/PWM1_CAP0/T0_MAT0/MC_2A/SSP0_SSEL/LCD_VD14/LCD_VD22) U13.6(R1) U13.11(R6)
VD23: U3.92(P1.29/USB_SDA1/PWM1_CAP1/T0_MAT1/MC_2B/U4_TXD/LCD_VD15/LCD_VD23) U13.7(R2) U13.12(R7)
NetD4_1: D4.1(A) L4.2 U14.1(SW)
NetQ1_1: Q1.1(G) R54.2
NetQ1_2: Q1.2(D) R50.1
NetR49_1: R49.1 R53.2 U14.5(OV)

Not connected (* = marked no-connect by the designer): U13 35(NC) 37(X1) 38(Y1) 39(X2) 40(Y2)

### Library data of the parts
C52-C54 = CAP: Capacitor
D4 = DIODE
L4 = INDUCTOR2
Q1 = MOSFET N
R49-R54 = RES2

## Nets that join several sheets
GND: Power (30 pins), CanRs232 (6 pins), EEPROM (8 pins), Enet (15 pins), Mem (27 pins), System (13 pins), TFT (11 pins)
NC: CanRs232 (U7.11 U7.14), EEPROM (U6.3), Enet (5 pins), Mem (37 pins)
VCC: Power (C33.1 U10.1 U10.4), CanRs232 (J1.1), System (J3.1), TFT (C53.1 L4.1 U14.6)
VDD3.3: Power (31 pins), CanRs232 (U7.19 U7.20), EEPROM (7 pins), Enet (20 pins), GPIO (R36.2), Mem (32 pins), System (10 pins), TFT (C52.1 U13.4)
nRESET: Enet (U8.40), Mem (U1.12), System (U3.29)
P2.10: GPIO (R36.1 U3.110), System (J3.2)
U0_RXD: CanRs232 (U3.202), System (J3.5)
U0_TXD: CanRs232 (U3.204), System (J3.4)